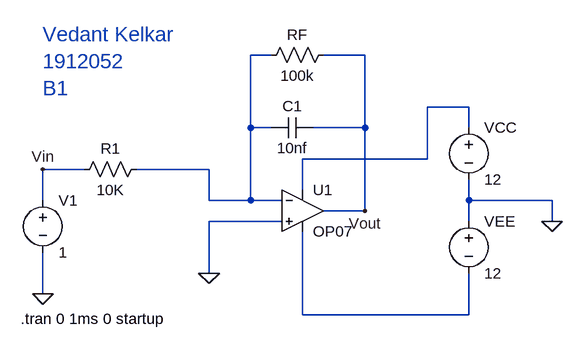
[diagram p0: schematic 1912052_LICD_exp2.asc]
1912052_LICD_exp2.asc, the LTspice schematic file:
Version 4
SHEET 1 880 680
WIRE 224 -128 192 -128
WIRE 368 -128 304 -128
WIRE 528 -48 464 -48
WIRE 192 -16 192 -128
WIRE 224 -16 192 -16
WIRE 368 -16 368 -128
WIRE 368 -16 288 -16
WIRE 528 -16 528 -48
WIRE 464 32 464 -48
WIRE 464 32 272 32
WIRE -64 48 -128 48
WIRE 128 48 16 48
WIRE 272 80 272 32
WIRE -128 96 -128 48
WIRE 128 96 128 48
WIRE 192 96 192 -16
WIRE 192 96 128 96
WIRE 240 96 192 96
WIRE 528 96 528 64
WIRE 656 96 528 96
WIRE 368 112 368 -16
WIRE 368 112 304 112
WIRE 240 128 128 128
WIRE 528 128 528 96
WIRE 656 128 656 96
WIRE 128 208 128 128
WIRE -128 240 -128 176
WIRE 272 272 272 144
WIRE 528 272 528 208
WIRE 528 272 272 272
FLAG 128 208 0
FLAG -128 240 0
FLAG 656 128 0
FLAG -128 48 Vin
FLAG 368 112 Vout
SYMBOL OpAmps\\OP07 272 48 R0
SYMATTR InstName U1
SYMBOL cap 288 -32 R90
WINDOW 0 -2 32 VBottom 2
WINDOW 3 32 32 VTop 2
SYMATTR InstName C1
SYMATTR Value 10nf
SYMBOL res 320 -144 R90
WINDOW 0 0 56 VBottom 2
WINDOW 3 32 56 VTop 2
SYMATTR InstName RF
SYMATTR Value 100k
SYMBOL res 32 32 R90
WINDOW 0 0 56 VBottom 2
WINDOW 3 32 56 VTop 2
SYMATTR InstName R1
SYMATTR Value 10K
SYMBOL voltage 528 -32 R0
WINDOW 123 0 0 Left 0
WINDOW 39 0 0 Left 0
SYMATTR InstName VCC
SYMATTR Value 12
SYMBOL voltage 528 112 R0
WINDOW 123 0 0 Left 0
WINDOW 39 0 0 Left 0
SYMATTR InstName VEE
SYMATTR Value 12
SYMBOL voltage -128 80 R0
WINDOW 123 0 0 Left 0
WINDOW 39 0 0 Left 0
SYMATTR InstName V1
SYMATTR Value 1
TEXT -128 -160 Left 3 ;Vedant Kelkar\n1912052\nB1
TEXT -162 278 Left 2 !.tran 0 1ms 0 startup

The netlist it stands for:
* 1912052_LICD_exp2.asc
XU1 0 N001 N002 N003 Vout LT1001  ; OP07, pins In+ In- V+ V- OUT
C1 Vout N001 10nf
RF Vout N001 100k
R1 N001 Vin 10K
VCC N002 0 12
VEE 0 N003 12
V1 Vin 0 1
* Vedant Kelkar
* 1912052
* B1
.tran 0 1ms 0 startup
.lib LTC.lib
.backanno
.end